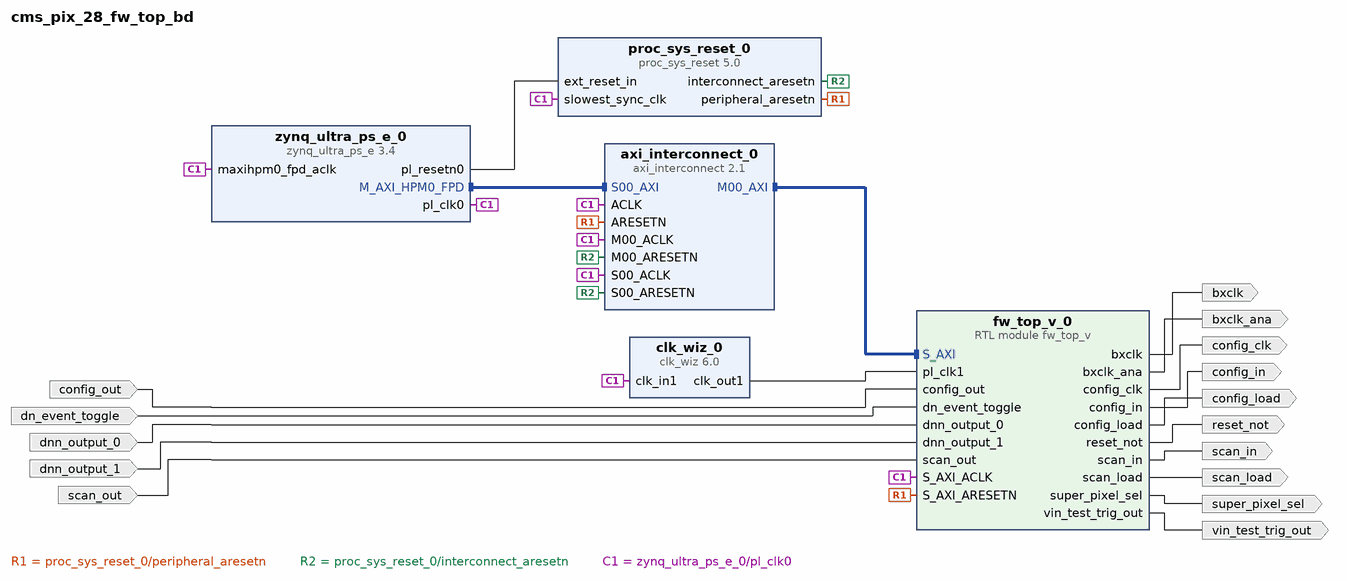
[diagram p0: block diagram of the top level]
# Vivado block design cms_pix_28_fw_top_bd, xczu9eg-ffvb1156-2-e, Vivado 2022.1
create_bd_design cms_pix_28_fw_top_bd

create_bd_port -dir I config_out
create_bd_port -dir I scan_out
create_bd_port -dir I dnn_output_0
create_bd_port -dir I dnn_output_1
create_bd_port -dir I dn_event_toggle
create_bd_port -dir O super_pixel_sel
create_bd_port -dir O scan_load
create_bd_port -dir O scan_in
create_bd_port -dir O -type rst reset_not
create_bd_port -dir O config_in
create_bd_port -dir O config_load
create_bd_port -dir O bxclk_ana
create_bd_port -dir O bxclk
create_bd_port -dir O vin_test_trig_out
create_bd_port -dir O -type clk config_clk

create_bd_cell -type ip -vlnv xilinx.com:ip:zynq_ultra_ps_e:3.4 zynq_ultra_ps_e_0
set_property -dict [list \
  CONFIG.PSU__CRL_APB__PL0_REF_CTRL__SRCSEL IOPLL \
  CONFIG.PSU__DDR_HIGH_ADDRESS_GUI_ENABLE 0 \
  CONFIG.PSU__MAXIGP0__DATA_WIDTH 128 \
  CONFIG.PSU__USE__M_AXI_GP0 1 \
  CONFIG.PSU__USE__M_AXI_GP2 0 \
] [get_bd_cells zynq_ultra_ps_e_0]
# 26 more settings of zynq_ultra_ps_e_0 are not shown: defaults, MIO pin electricals, DDR timing, and values the tool derives
create_bd_cell -type ip -vlnv xilinx.com:ip:proc_sys_reset:5.0 proc_sys_reset_0
create_bd_cell -type ip -vlnv xilinx.com:ip:axi_interconnect:2.1 axi_interconnect_0
set_property -dict {CONFIG.NUM_MI 1} [get_bd_cells axi_interconnect_0]
create_bd_cell -type ip -vlnv xilinx.com:ip:clk_wiz:6.0 clk_wiz_0
set_property -dict [list \
  CONFIG.AUTO_PRIMITIVE MMCM \
  CONFIG.CLKOUT1_DRIVES Buffer \
  CONFIG.CLKOUT1_JITTER 90.075 \
  CONFIG.CLKOUT1_PHASE_ERROR 87.181 \
  CONFIG.CLKOUT1_REQUESTED_OUT_FREQ 399.99600 \
  CONFIG.CLKOUT2_DRIVES Buffer \
  CONFIG.CLKOUT3_DRIVES Buffer \
  CONFIG.CLKOUT4_DRIVES Buffer \
  CONFIG.CLKOUT5_DRIVES Buffer \
  CONFIG.CLKOUT6_DRIVES Buffer \
  CONFIG.CLKOUT7_DRIVES Buffer \
  CONFIG.FEEDBACK_SOURCE FDBK_AUTO \
  CONFIG.MMCM_BANDWIDTH OPTIMIZED \
  CONFIG.MMCM_CLKFBOUT_MULT_F 12.000 \
  CONFIG.MMCM_CLKOUT0_DIVIDE_F 3.000 \
  CONFIG.MMCM_COMPENSATION AUTO \
  CONFIG.OPTIMIZE_CLOCKING_STRUCTURE_EN true \
  CONFIG.PRIMITIVE Auto \
  CONFIG.PRIM_SOURCE No_buffer \
  CONFIG.SECONDARY_SOURCE Single_ended_clock_capable_pin \
  CONFIG.USE_LOCKED false \
  CONFIG.USE_PHASE_ALIGNMENT true \
  CONFIG.USE_RESET false \
] [get_bd_cells clk_wiz_0]
create_bd_cell -type module -reference fw_top_v fw_top_v_0

# ---- connections ----

connect_bd_intf_net [get_bd_intf_pins fw_top_v_0/S_AXI] [get_bd_intf_pins axi_interconnect_0/M00_AXI]
connect_bd_intf_net [get_bd_intf_pins zynq_ultra_ps_e_0/M_AXI_HPM0_FPD] [get_bd_intf_pins axi_interconnect_0/S00_AXI]
connect_bd_net -net ARESETN_1 [get_bd_pins proc_sys_reset_0/peripheral_aresetn] \
  [get_bd_pins axi_interconnect_0/ARESETN] [get_bd_pins fw_top_v_0/S_AXI_ARESETN]
connect_bd_net [get_bd_pins clk_wiz_0/clk_out1] [get_bd_pins fw_top_v_0/pl_clk1]
connect_bd_net [get_bd_ports config_out] [get_bd_pins fw_top_v_0/config_out]
connect_bd_net [get_bd_ports dn_event_toggle] [get_bd_pins fw_top_v_0/dn_event_toggle]
connect_bd_net -net dnn_output_0_1 [get_bd_ports dnn_output_0] [get_bd_pins fw_top_v_0/dnn_output_0]
connect_bd_net -net dnn_output_1_1 [get_bd_ports dnn_output_1] [get_bd_pins fw_top_v_0/dnn_output_1]
connect_bd_net [get_bd_pins fw_top_v_0/bxclk] [get_bd_ports bxclk]
connect_bd_net [get_bd_pins fw_top_v_0/bxclk_ana] [get_bd_ports bxclk_ana]
connect_bd_net [get_bd_pins fw_top_v_0/config_clk] [get_bd_ports config_clk]
connect_bd_net [get_bd_pins fw_top_v_0/config_in] [get_bd_ports config_in]
connect_bd_net [get_bd_pins fw_top_v_0/config_load] [get_bd_ports config_load]
connect_bd_net [get_bd_pins fw_top_v_0/reset_not] [get_bd_ports reset_not]
connect_bd_net [get_bd_pins fw_top_v_0/scan_in] [get_bd_ports scan_in]
connect_bd_net [get_bd_pins fw_top_v_0/scan_load] [get_bd_ports scan_load]
connect_bd_net [get_bd_pins fw_top_v_0/super_pixel_sel] [get_bd_ports super_pixel_sel]
connect_bd_net [get_bd_pins fw_top_v_0/vin_test_trig_out] [get_bd_ports vin_test_trig_out]
connect_bd_net [get_bd_pins proc_sys_reset_0/interconnect_aresetn] \
  [get_bd_pins axi_interconnect_0/S00_ARESETN] [get_bd_pins axi_interconnect_0/M00_ARESETN]
connect_bd_net [get_bd_ports scan_out] [get_bd_pins fw_top_v_0/scan_out]
connect_bd_net [get_bd_pins zynq_ultra_ps_e_0/pl_clk0] \
  [get_bd_pins zynq_ultra_ps_e_0/maxihpm0_fpd_aclk] [get_bd_pins proc_sys_reset_0/slowest_sync_clk] \
  [get_bd_pins axi_interconnect_0/ACLK] [get_bd_pins axi_interconnect_0/S00_ACLK] [get_bd_pins axi_interconnect_0/M00_ACLK] \
  [get_bd_pins clk_wiz_0/clk_in1] [get_bd_pins fw_top_v_0/S_AXI_ACLK]
connect_bd_net [get_bd_pins zynq_ultra_ps_e_0/pl_resetn0] [get_bd_pins proc_sys_reset_0/ext_reset_in]

# ---- address map ----
assign_bd_address -offset 0x00A0000000 -range 4K -target_address_space [get_bd_addr_spaces zynq_ultra_ps_e_0/Data] [get_bd_addr_segs fw_top_v_0/S_AXI/reg0]

validate_bd_design
save_bd_design
